# EAGLE design cpu_board (EAGLE 7.2.0)
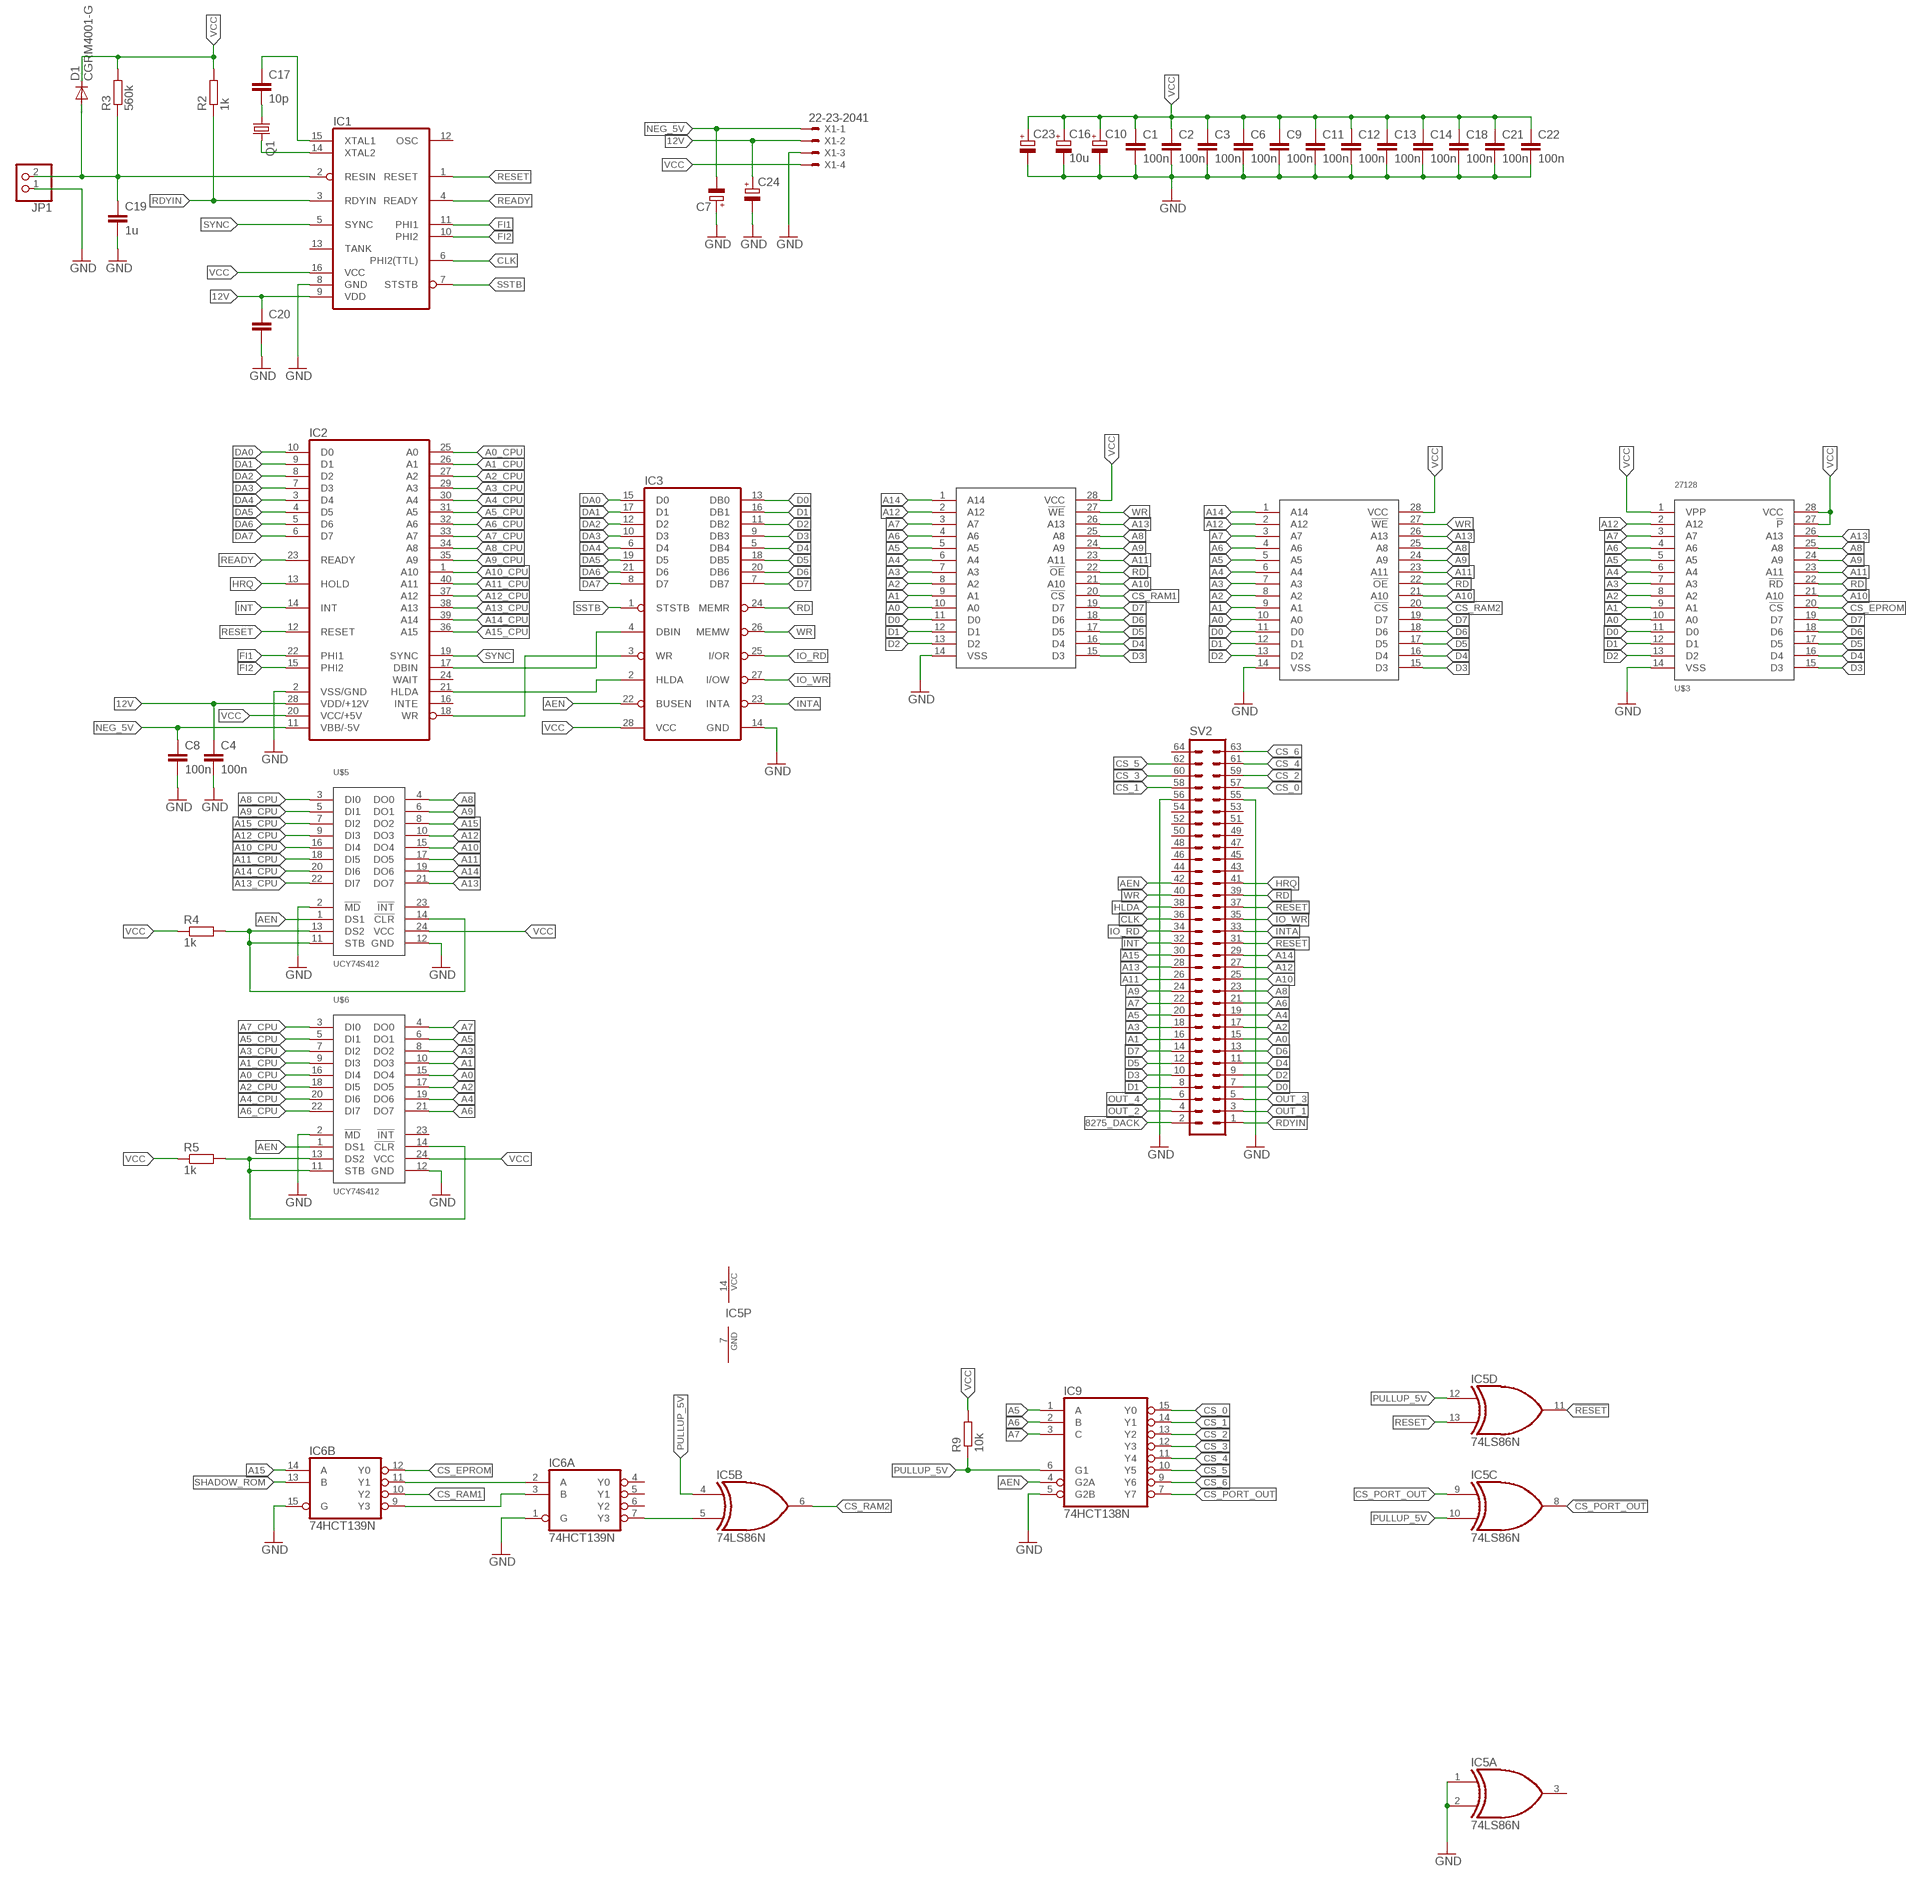
[diagram p0: schematic, sheet 1, part 1 of 2]
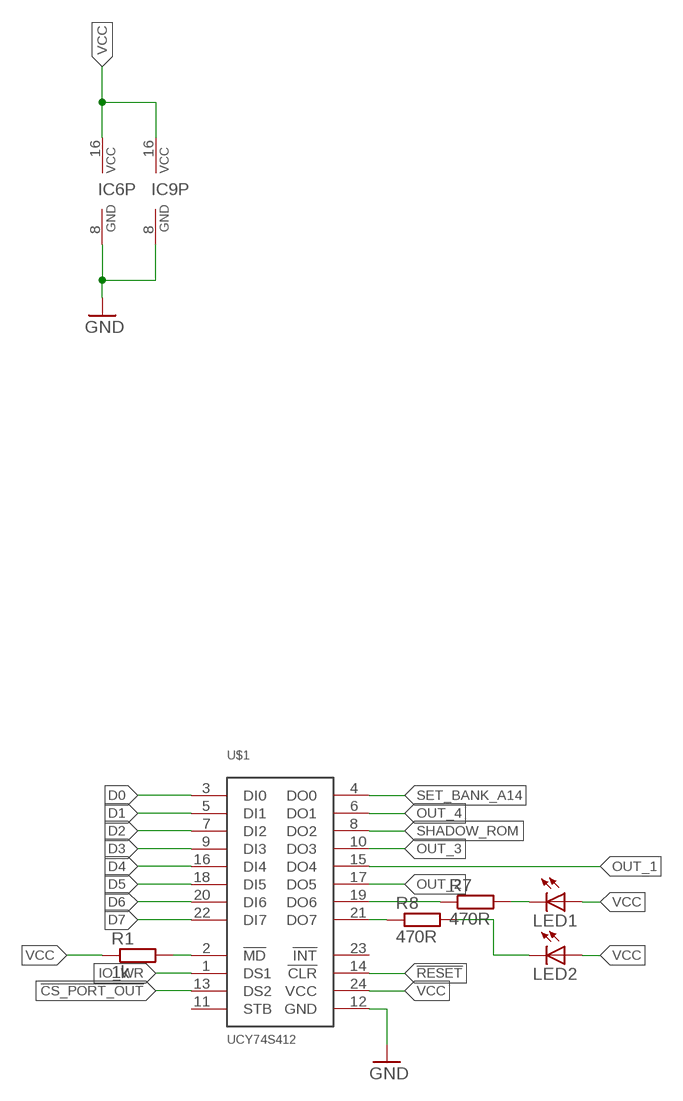
[diagram p1: schematic, sheet 1, part 2 of 2]

## Parts
C1  100n  C-EUC1206  [C1206]
C2  100n  C-EUC1206  [C1206]
C3  100n  C-EUC1206  [C1206]
C4  100n  C-EUC1206  [C1206]
C6  100n  C-EUC1206  [C1206]
C7  CPOL-EUE2.5-7  [E2,5-7]
C8  100n  C-EUC1206  [C1206]
C9  100n  C-EUC1206  [C1206]
C10  CPOL-EUE5-10.5  [E5-10,5]
C11  100n  C-EUC0805  [C0805]
C12  100n  C-EUC0805  [C0805]
C13  100n  C-EUC0805  [C0805]
C14  100n  C-EUC1206  [C1206]
C16  10u  CPOL-EUSMCB  [SMC_B]
C17  10p  C-EUC0603  [C0603]
C18  100n  C-EUC0603  [C0603]
C19  1u  C-EUC0603  [C0603]
C20  C-EUC0603  [C0603]
C21  100n  C-EUC1206  [C1206]
C22  100n  C-EUC0603  [C0603]
C23  CPOL-EUE5-10.5  [E5-10,5]
C24  CPOL-EUE3.5-8  [E3,5-8]
D1  CGRM4001-G  [SOD-123_MINI-SMA]
IC1  8224  [DIL16]
IC2  8080  [DIL40]
IC3  8228  [DIL28-6]
IC5  74LS86N  [DIL14]
IC6  74HCT139N  [DIL16]
IC9  74HCT138N  [DIL16]
JP1  PINHD-1X2  [1X02]
LED1  LED3MM  [LED3MM]
LED2  LED3MM  [LED3MM]
Q1  CRYSTALHC49U-V  [HC49U-V]
R1  1k  R-EU_M1206  [M1206]
R2  1k  R-EU_R0603  [R0603]
R3  560k  R-EU_R0603  [R0603]
R4  1k  R-EU_R0603  [R0603]
R5  1k  R-EU_0204/7  [0204/7]
R7  470R  R-EU_R0603  [R0603]
R8  470R  R-EU_R0603  [R0603]
R9  10k  R-EU_R0603  [R0603]
SV2  ML64L  [ML64L]
U$1  UCY74S412  [DIL24-6]
U$2  62256  [DIL28-6]
U$3  27128  [DIL28]
U$4  62256  [DIL28-6]
U$5  UCY74S412  [DIL24-6]
U$6  UCY74S412  [DIL24-6]
X1  22-23-2041  [22-23-2041]

## Nets
12V: C4.1 C20.1 C24.+ IC1.9(VDD) IC2.28(VDD/+12V) X1.2
8275_DACK: SV2.2
!CS_PORT_OUT: IC5.8(C:O) U$1.13(DS2)
!RESET: IC5.11(D:O) SV2.37 U$1.14(!CLR)
A0: SV2.15 U$2.10(A0) U$3.10(A0) U$4.10(A0) U$6.15(DO4)
A0_CPU: IC2.25(A0) U$6.16(DI4)
A1: SV2.16 U$2.9(A1) U$3.9(A1) U$4.9(A1) U$6.10(DO3)
A1_CPU: IC2.26(A1) U$6.9(DI3)
A2: SV2.17 U$2.8(A2) U$3.8(A2) U$4.8(A2) U$6.17(DO5)
A2_CPU: IC2.27(A2) U$6.18(DI5)
A3: SV2.18 U$2.7(A3) U$3.7(A3) U$4.7(A3) U$6.8(DO2)
A3_CPU: IC2.29(A3) U$6.7(DI2)
A4: SV2.19 U$2.6(A4) U$3.6(A4) U$4.6(A4) U$6.19(DO6)
A4_CPU: IC2.30(A4) U$6.20(DI6)
A5: IC9.1(A) SV2.20 U$2.5(A5) U$3.5(A5) U$4.5(A5) U$6.6(DO1)
A5_CPU: IC2.31(A5) U$6.5(DI1)
A6: IC9.2(B) SV2.21 U$2.4(A6) U$3.4(A6) U$4.4(A6) U$6.21(DO7)
A6_CPU: IC2.32(A6) U$6.22(DI7)
A7: IC9.3(C) SV2.22 U$2.3(A7) U$3.3(A7) U$4.3(A7) U$6.4(DO0)
A7_CPU: IC2.33(A7) U$6.3(DI0)
A8: SV2.23 U$2.25(A8) U$3.25(A8) U$4.25(A8) U$5.4(DO0)
A8_CPU: IC2.34(A8) U$5.3(DI0)
A9: SV2.24 U$2.24(A9) U$3.24(A9) U$4.24(A9) U$5.6(DO1)
A9_CPU: IC2.35(A9) U$5.5(DI1)
A10: SV2.25 U$2.21(A10) U$3.21(A10) U$4.21(A10) U$5.15(DO4)
A10_CPU: IC2.1(A10) U$5.16(DI4)
A11: SV2.26 U$2.23(A11) U$3.23(A11) U$4.23(A11) U$5.17(DO5)
A11_CPU: IC2.40(A11) U$5.18(DI5)
A12: SV2.27 U$2.2(A12) U$3.2(A12) U$4.2(A12) U$5.10(DO3)
A12_CPU: IC2.37(A12) U$5.9(DI3)
A13: SV2.28 U$2.26(A13) U$3.26(A13) U$4.26(A13) U$5.21(DO7)
A13_CPU: IC2.38(A13) U$5.22(DI7)
A14: SV2.29 U$2.1(A14) U$4.1(A14) U$5.19(DO6)
A14_CPU: IC2.39(A14) U$5.20(DI6)
A15: IC6.14(B:A) SV2.30 U$5.8(DO2)
A15_CPU: IC2.36(A15) U$5.7(DI2)
AEN: IC3.22(BUSEN) IC9.4(G2A) SV2.42 U$5.1(DS1) U$6.1(DS1)
CLK: IC1.6(PHI2(TTL)) SV2.36
CS_0: IC9.15(Y0) SV2.57
CS_1: IC9.14(Y1) SV2.58
CS_2: IC9.13(Y2) SV2.59
CS_3: IC9.12(Y3) SV2.60
CS_4: IC9.11(Y4) SV2.61
CS_5: IC9.10(Y5) SV2.62
CS_6: IC9.9(Y6) SV2.63
CS_EPROM: IC6.12(B:Y0) U$3.20(!CS)
CS_PORT_OUT: IC5.9(C:I0) IC9.7(Y7)
CS_RAM1: IC6.10(B:Y2) U$4.20(!CS)
CS_RAM2: IC5.6(B:O) U$2.20(!CS)
D0: IC3.13(DB0) SV2.7 U$1.3(DI0) U$2.11(D0) U$3.11(D0) U$4.11(D0)
D1: IC3.16(DB1) SV2.8 U$1.5(DI1) U$2.12(D1) U$3.12(D1) U$4.12(D1)
D2: IC3.11(DB2) SV2.9 U$1.7(DI2) U$2.13(D2) U$3.13(D2) U$4.13(D2)
D3: IC3.9(DB3) SV2.10 U$1.9(DI3) U$2.15(D3) U$3.15(D3) U$4.15(D3)
D4: IC3.5(DB4) SV2.11 U$1.16(DI4) U$2.16(D4) U$3.16(D4) U$4.16(D4)
D5: IC3.18(DB5) SV2.12 U$1.18(DI5) U$2.17(D5) U$3.17(D5) U$4.17(D5)
D6: IC3.20(DB6) SV2.13 U$1.20(DI6) U$2.18(D6) U$3.18(D6) U$4.18(D6)
D7: IC3.7(DB7) SV2.14 U$1.22(DI7) U$2.19(D7) U$3.19(D7) U$4.19(D7)
DA0: IC2.10(D0) IC3.15(D0)
DA1: IC2.9(D1) IC3.17(D1)
DA2: IC2.8(D2) IC3.12(D2)
DA3: IC2.7(D3) IC3.10(D3)
DA4: IC2.3(D4) IC3.6(D4)
DA5: IC2.4(D5) IC3.19(D5)
DA6: IC2.5(D6) IC3.21(D6)
DA7: IC2.6(D7) IC3.8(D7)
FI1: IC1.11(PHI1) IC2.22(PHI1)
FI2: IC1.10(PHI2) IC2.15(PHI2)
GND: C1.2 C2.2 C3.2 C4.2 C6.2 C7.+ C8.2 C9.2 C10.- C11.2 C12.2 C13.2 C14.2 C16.- C18.2 C19.2 C20.2 C21.2 C22.2 C23.- C24.- IC1.8(GND) IC2.2(VSS/GND) IC3.14(GND) IC5.1(A:I0) IC5.2(A:I1) IC6.1(A:G) IC6.8(P:GND) IC6.15(B:G) IC9.5(G2B) IC9.8(GND) JP1.1 SV2.55 SV2.56 U$1.12(GND) U$2.14(VSS) U$3.14(VSS) U$4.14(VSS) U$5.2(!MD) U$5.12(GND) U$6.2(!MD) U$6.12(GND) X1.3
HLDA: IC2.21(HLDA) IC3.2(HLDA) SV2.38
HRQ: IC2.13(HOLD) SV2.41
INT: IC2.14(INT) SV2.32
INTA: IC3.23(INTA) SV2.33
IO_RD: IC3.25(I/OR) SV2.34
IO_WR: IC3.27(I/OW) SV2.35 U$1.1(DS1)
N$1: IC2.17(DBIN) IC3.4(DBIN)
N$2: IC6.2(A:A) IC6.11(B:Y1)
N$3: R7.1 U$1.19(DO6)
N$4: LED1.K(C) R7.2
N$5: IC2.18(WR) IC3.3(WR)
N$6: R8.1 U$1.21(DO7)
N$7: R1.2 U$1.2(!MD)
N$8: IC6.3(A:B) IC6.9(B:Y3)
N$9: IC1.14(XTAL2) Q1.2
N$10: C17.2 Q1.1
N$11: C17.1 IC1.15(XTAL1)
N$12: C19.1 D1.A IC1.2(RESIN) JP1.2 R3.1
N$13: R5.2 U$6.11(STB) U$6.13(DS2) U$6.14(!CLR)
N$15: R4.2 U$5.11(STB) U$5.13(DS2) U$5.14(!CLR)
N$16: IC5.5(B:I1) IC6.7(A:Y3)
N$17: LED2.K(C) R8.2
NEG_5V: C7.- C8.1 IC2.11(VBB/-5V) X1.1
OUT_1: SV2.3 U$1.15(DO4)
OUT_2: SV2.4 U$1.17(DO5)
OUT_3: SV2.5 U$1.10(DO3)
OUT_4: SV2.6 U$1.6(DO1)
PULLUP_5V: IC5.4(B:I0) IC5.10(C:I1) IC5.12(D:I0) IC9.6(G1) R9.1
RD: IC3.24(MEMR) SV2.39 U$2.22(!OE) U$3.22(!RD) U$4.22(!OE)
RDYIN: IC1.3(RDYIN) R2.1 SV2.1
READY: IC1.4(READY) IC2.23(READY)
RESET: IC1.1(RESET) IC2.12(RESET) IC5.13(D:I1) SV2.31
SET_BANK_A14: U$1.4(DO0)
SHADOW_ROM: IC6.13(B:B) U$1.8(DO2)
SSTB: IC1.7(STSTB) IC3.1(STSTB)
SYNC: IC1.5(SYNC) IC2.19(SYNC)
VCC: C1.1 C2.1 C3.1 C6.1 C9.1 C10.+ C11.1 C12.1 C13.1 C14.1 C16.+ C18.1 C21.1 C22.1 C23.+ D1.C IC1.16(VCC) IC2.20(VCC/+5V) IC3.28(VCC) IC6.16(P:VCC) IC9.16(VCC) LED1.A LED2.A R1.1 R2.2 R3.2 R4.1 R5.1 R9.2 U$1.24(VCC) U$2.28(VCC) U$3.1(VPP) U$3.27(!P) U$3.28(VCC) U$4.28(VCC) U$5.24(VCC) U$6.24(VCC) X1.4
WR: IC3.26(MEMW) SV2.40 U$2.27(!WE) U$4.27(!WE)
Unconnected: IC1.12(OSC) IC1.13(TANK) IC2.16(INTE) IC2.24(WAIT) IC5.3(A:O) IC6.4(A:Y0) IC6.5(A:Y1) IC6.6(A:Y2) SV2.43 SV2.44 SV2.45 SV2.46 SV2.47 SV2.48 SV2.49 SV2.50 SV2.51 SV2.52 SV2.53 SV2.54 SV2.64 U$1.11(STB) U$1.23(!INT) U$5.23(!INT) U$6.23(!INT)

## Power pins joined to a net without a drawn wire
GND: IC5.7(P:GND)
VCC: IC5.14(P:VCC)

## Library data of the parts
C1-C4 C6 C8 C9 C11-C14 C17-C22 = rcl:C-EU: CAPACITOR, European symbol
C7 C10 C16 C23 C24 = rcl:CPOL-EU: POLARIZED CAPACITOR, European symbol
D1 = diode:CGRM400*-G: Molded plasitc,JEDEC SOD-123/Mini SMA Source: Comchip CGRM4001-G.pdf
IC1 = micro-intel:8224: MICROCOMPUTER/PERIPHERAL DEVICE; OC_FARNELL: unknown; OC_NEWARK: unknown
IC2 = micro-intel:8080: MICROCOMPUTER/PERIPHERAL DEVICE; OC_FARNELL: unknown; OC_NEWARK: unknown
IC3 = micro-intel:8228: MICROCOMPUTER/PERIPHERAL DEVICE; OC_FARNELL: unknown; OC_NEWARK: unknown
IC5 = 74xx-us:74*86: Quad 2-input EXCLUSIV-OR (XOR) gate
IC6 = 74xx-eu:74*139: Dual 2-line to 4-line DECODER/DEMULTIPLEXER
IC9 = 74xx-eu:74*138: 3-line to 8-line DECODER/DEMULTIPLEXER
JP1 = pinhead:PINHD-1X2: PIN HEADER
LED1 LED2 = led:LED: LED OSRAM: - CHIPLED LG R971, LG N971, LY N971, LG Q971, LY Q971, LO R971, LY R971 LH N974, LH R974 LS Q976, LO Q976, LY Q976 LO Q996 - Hyper CHIPLED LW Q18S LB Q993, LB Q99A, LB R99A - SideLED LS A670, LO A670, LY A670, LG A670, LP A670 LB A673, LV A673, LT A673, LW A673 LH A674 LY A675 LS A676, LA A676, LO A676, LY A676, LW A676 LS A679, LY A679, LG A679 - Hyper Micro SIDELED® LS Y876, LA Y876, LO Y876, LY Y876 LT Y87S - SmartLED LW L88C, LW L88S LB L89C, LB L89S, LG L890 LS L89K, LO L89K, LY L89K LS L896, LA L896, LO L896, LY L896 - TOPLED LS T670, LO T670, LY T670, LG T670, LP T670 LSG T670, LSP T670, LSY T670, LOP T670, LYG T670 LG T671, LOG T671, LSG T671 LB T673, LV T673, LT T673, LW T673 LH T674 LS T676, LA T676, LO T676, LY T676, LB T676, LH T676, LSB T676, LW T676 LB T67C, LV T67C, LT T67C, LS T67K, LO T67K, LY T67K, LW E67C LS E67B, LA E67B, LO E67B, LY E67B, LB E67C, LV E67C, LT E67C LW T67C LS T679, LY T679, LG T679 LS T770, LO T770, LY T770, LG T770, LP T770 LB T773, LV T773, LT T773, LW T773 LH T774 LS E675, LA E675, LY E675, LS T675 LS T776, LA T776, LO T776, LY T776, LB T776 LHGB T686 LT T68C, LB T68C - Hyper Mini TOPLED® LB M676 - Mini TOPLED Santana® LG M470 LS M47K, LO M47K, LY M47K Source: http://www.osram.convergy.de LUXEON: - LUMILED® LXK2-PW12-R00, LXK2-PW12-S00, LXK2-PW14-U00, LXK2-PW14-V00 LXK2-PM12-R00, LXK2-PM12-S00, LXK2-PM14-U00 LXK2-PE12-Q00, LXK2-PE12-R00, LXK2-PE12-S00, LXK2-PE14-T00, LXK2-PE14-U00 LXK2-PB12-K00, LXK2-PB12-L00, LXK2-PB12-M00, LXK2-PB14-N00, LXK2-PB14-P00, LXK2-PB14-Q00 LXK2-PR12-L00, LXK2-PR12-M00, LXK2-PR14-Q00, LXK2-PR14-R00 LXK2-PD12-Q00, LXK2-PD12-R00, LXK2-PD12-S00 LXK2-PH12-R00, LXK2-PH12-S00 LXK2-PL12-P00, LXK2-PL12-Q00, LXK2-PL12-R00 Source: www.luxeon.com KINGBRIGHT: KA-3528ASYC Source: www.kingbright.com
Q1 = crystal:CRYSTAL: CRYSTAL; OC_FARNELL: 1666969; OC_NEWARK: unknown
R1-R5 R7-R9 = rcl:R-EU_: RESISTOR, European symbol
SV2 = con-harting-ml:ML64: HARTING; OC_FARNELL: unknown; OC_NEWARK: unknown
U$1 U$5 U$6 = mw:UCY74S412
U$2 U$4 = memory-sram:62256
U$3 = mw:27128
X1 = con-molex:22-23-2041: .100" (2.54mm) Center Header - 4 Pin; MF: MOLEX; MPN: 22-23-2041; OC_FARNELL: 1462920; OC_NEWARK: 38C0355

## Board
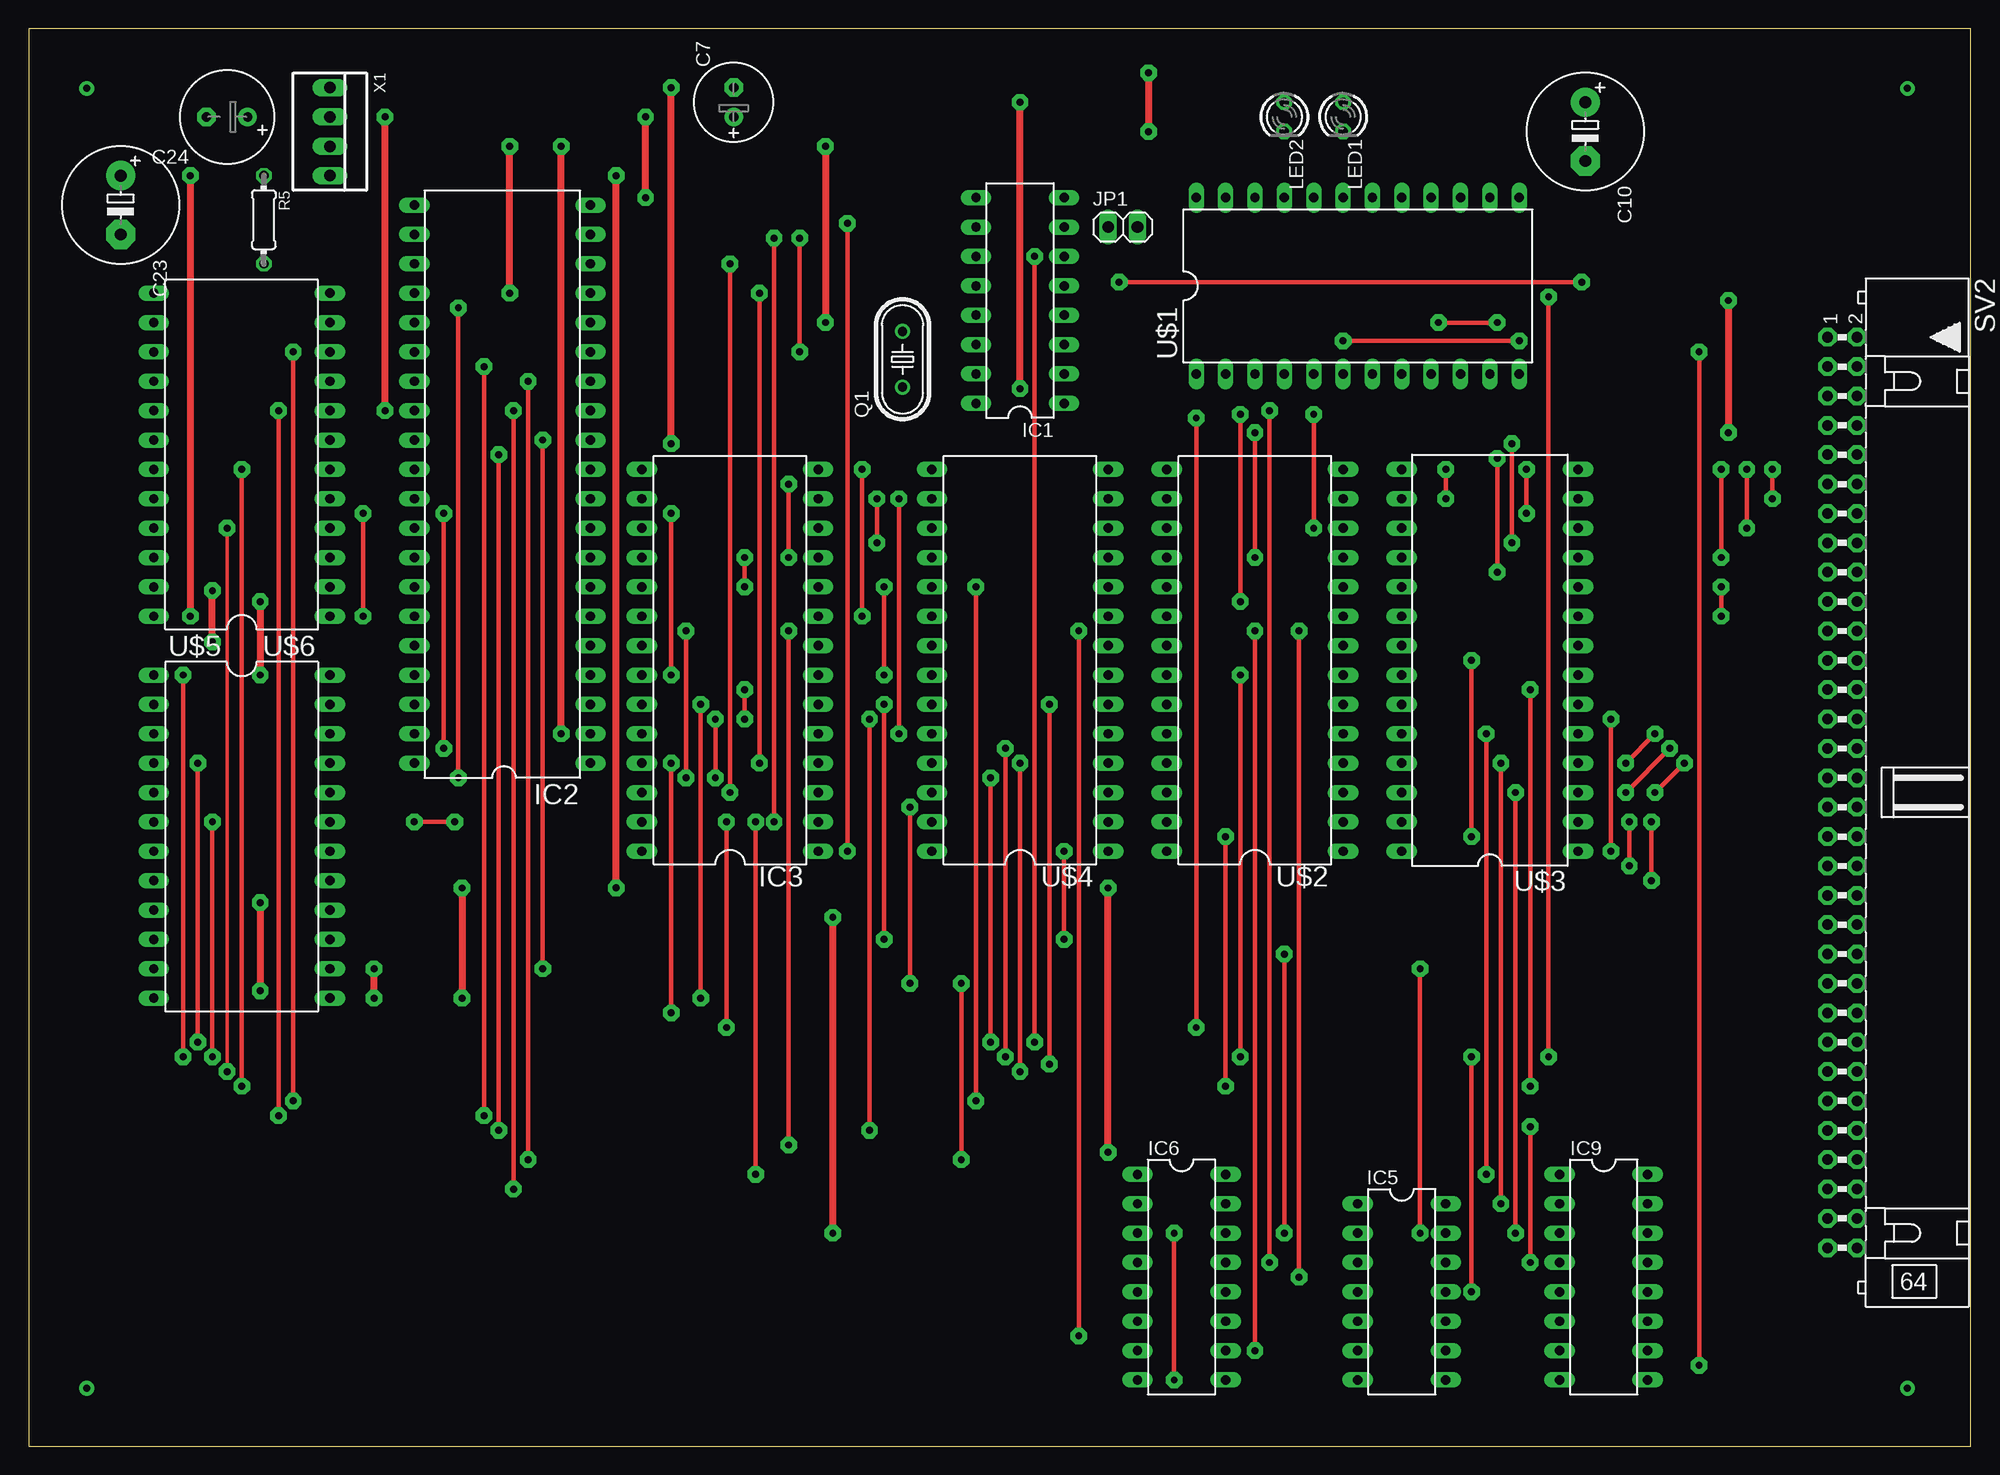
[diagram p2: board, top side]
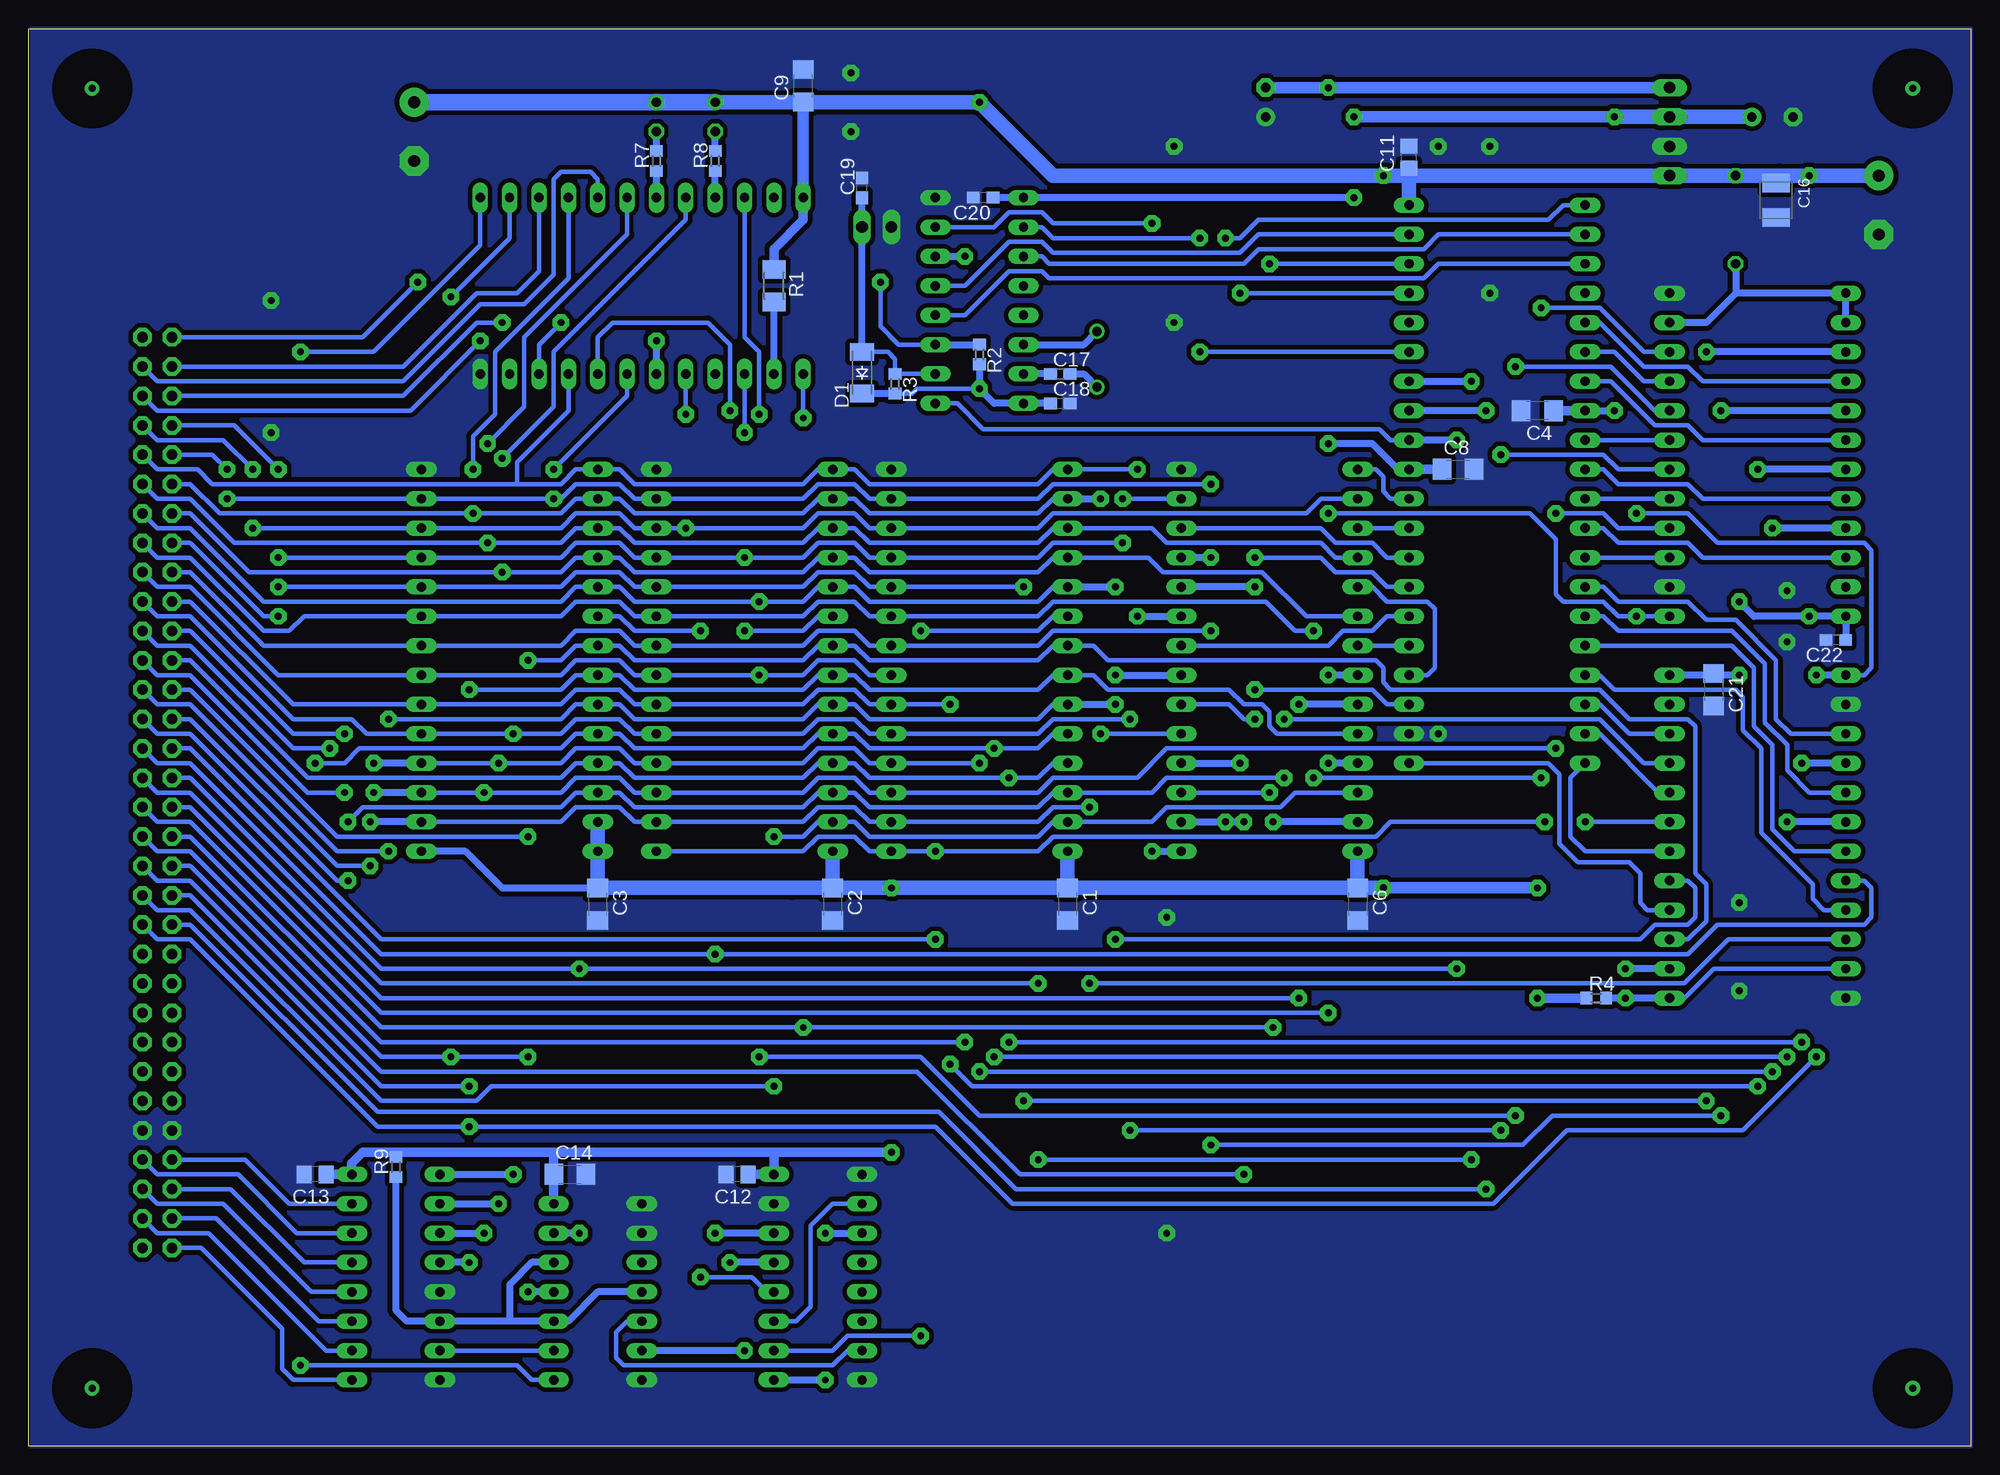
[diagram p3: board, bottom side, seen from below]

Size 167.94 x 122.55 mm. Coordinates in mm from the lower left corner, seen from the top.
Outline: 0,0 167.94,0 167.94,122.55 0,122.55 0,0
Copper layers (1*16): Top 0.035mm / dielectric 1.5mm / Bottom 0.035mm
Design rules "default *": minimum track width 10mil, minimum drill 24mil, track to track 8mil, track to pad 8mil, pad to pad 8mil, via to via 8mil, smd to smd 8mil, copper to edge 0mil, drill to drill 8mil, minimum pad ring 10mil, minimum via ring 8mil, stop-mask expansion 4mil, vias tented up to drill 0mil, thermal gap 10mil
bRestrict: area 2,2 to 8,8; area 2,114.3 to 8,120.4; area 159.4,2 to 165.5,8; area 159.4,114.3 to 165.5,120.4

### Footprints (pad centres in the part's own frame; a part is rotated, then mirrored left to right if it is on the bottom)
C1206 = smd 1.6 x 1.8: 1 -1.4,0; 2 1.4,0
E2,5-7 = drill 0.813 pad 1.6: + -1.27,0 | drill 0.813 pad 1.6 octagon: - 1.27,0
E5-10,5 = drill 1.016 pad 2.54: + -2.54,0 | drill 1.016 pad 2.54 octagon: - 2.54,0
C0805 = smd 1.3 x 1.5: 1 -0.95,0; 2 0.95,0
SMC_B = smd 1.6 x 2.4: + -1.5,0; - 1.5,0
C0603 = smd 1.1 x 1: 1 -0.85,0; 2 0.85,0
E3,5-8 = drill 0.813 pad 1.6: + -1.778,0 | drill 0.813 pad 1.6 octagon: - 1.778,0
SOD-123_MINI-SMA = smd 1.5 x 2.1: A 1.8,0; C -1.8,0
DIL16 = drill 0.813 long: 1 -8.89,-3.81; 2 -6.35,-3.81; 3 -3.81,-3.81; 4 -1.27,-3.81; 5 1.27,-3.81; 6 3.81,-3.81; 7 6.35,-3.81; 8 8.89,-3.81; 9 8.89,3.81; 10 6.35,3.81; 11 3.81,3.81; 12 1.27,3.81; 13 -1.27,3.81; 14 -3.81,3.81; 15 -6.35,3.81; 16 -8.89,3.81
DIL40 = drill 0.813 long: 1 -24.13,-7.62; 2 -21.59,-7.62; 3 -19.05,-7.62; 4 -16.51,-7.62; 5 -13.97,-7.62; 6 -11.43,-7.62; 7 -8.89,-7.62; 8 -6.35,-7.62; 9 -3.81,-7.62; 10 -1.27,-7.62; 11 1.27,-7.62; 12 3.81,-7.62; 13 6.35,-7.62; 14 8.89,-7.62; 15 11.43,-7.62; 16 13.97,-7.62; 17 16.51,-7.62; 18 19.05,-7.62; 19 21.59,-7.62; 20 24.13,-7.62; 21 24.13,7.62; 22 21.59,7.62; 23 19.05,7.62; 24 16.51,7.62; 25 13.97,7.62; 26 11.43,7.62; 27 8.89,7.62; 28 6.35,7.62; 29 3.81,7.62; 30 1.27,7.62; 31 -1.27,7.62; 32 -3.81,7.62; 33 -6.35,7.62; 34 -8.89,7.62; 35 -11.43,7.62; 36 -13.97,7.62; 37 -16.51,7.62; 38 -19.05,7.62; 39 -21.59,7.62; 40 -24.13,7.62
DIL28-6 = drill 0.813 long: 1 -16.51,-7.62; 2 -13.97,-7.62; 3 -11.43,-7.62; 4 -8.89,-7.62; 5 -6.35,-7.62; 6 -3.81,-7.62; 7 -1.27,-7.62; 8 1.27,-7.62; 9 3.81,-7.62; 10 6.35,-7.62; 11 8.89,-7.62; 12 11.43,-7.62; 13 13.97,-7.62; 14 16.51,-7.62; 15 16.51,7.62; 16 13.97,7.62; 17 11.43,7.62; 18 8.89,7.62; 19 6.35,7.62; 20 3.81,7.62; 21 1.27,7.62; 22 -1.27,7.62; 23 -3.81,7.62; 24 -6.35,7.62; 25 -8.89,7.62; 26 -11.43,7.62; 27 -13.97,7.62; 28 -16.51,7.62
DIL14 = drill 0.813 long: 1 -7.62,-3.81; 2 -5.08,-3.81; 3 -2.54,-3.81; 4 0,-3.81; 5 2.54,-3.81; 6 5.08,-3.81; 7 7.62,-3.81; 8 7.62,3.81; 9 5.08,3.81; 10 2.54,3.81; 11 0,3.81; 12 -2.54,3.81; 13 -5.08,3.81; 14 -7.62,3.81
1X02 = drill 1.016 long: 1 -1.27,0; 2 1.27,0
LED3MM = drill 0.813 octagon: A -1.27,0; K 1.27,0
HC49U-V = drill 0.813: 1 -2.413,0; 2 2.413,0
M1206 = smd 1.6 x 2: 1 -1.4,0; 2 1.4,0
R0603 = smd 1 x 1.1: 1 -0.85,0; 2 0.85,0
0204/7 = drill 0.813 octagon: 1 -3.81,0; 2 3.81,0
ML64L = drill 0.914 pad 1.6 octagon: 1 -39.37,-1.27; 2 -39.37,1.27; 3 -36.83,-1.27; 4 -36.83,1.27; 5 -34.29,-1.27; 6 -34.29,1.27; 7 -31.75,-1.27; 8 -31.75,1.27; 9 -29.21,-1.27; 10 -29.21,1.27; 11 -26.67,-1.27; 12 -26.67,1.27; 13 -24.13,-1.27; 14 -24.13,1.27; 15 -21.59,-1.27; 16 -21.59,1.27; 17 -19.05,-1.27; 18 -19.05,1.27; 19 -16.51,-1.27; 20 -16.51,1.27; 21 -13.97,-1.27; 22 -13.97,1.27; 23 -11.43,-1.27; 24 -11.43,1.27; 25 -8.89,-1.27; 26 -8.89,1.27; 27 -6.35,-1.27; 28 -6.35,1.27; 29 -3.81,-1.27; 30 -3.81,1.27; 31 -1.27,-1.27; 32 -1.27,1.27; 33 1.27,-1.27; 34 1.27,1.27; 35 3.81,-1.27; 36 3.81,1.27; 37 6.35,-1.27; 38 6.35,1.27; 39 8.89,-1.27; 40 8.89,1.27; 41 11.43,-1.27; 42 11.43,1.27; 43 13.97,-1.27; 44 13.97,1.27; 45 16.51,-1.27; 46 16.51,1.27; 47 19.05,-1.27; 48 19.05,1.27; 49 21.59,-1.27; 50 21.59,1.27; 51 24.13,-1.27; 52 24.13,1.27; 53 26.67,-1.27; 54 26.67,1.27; 55 29.21,-1.27; 56 29.21,1.27; 57 31.75,-1.27; 58 31.75,1.27; 59 34.29,-1.27; 60 34.29,1.27; 61 36.83,-1.27; 62 36.83,1.27; 63 39.37,-1.27; 64 39.37,1.27
DIL24-6 = drill 0.813 long: 1 -13.97,-7.62; 2 -11.43,-7.62; 3 -8.89,-7.62; 4 -6.35,-7.62; 5 -3.81,-7.62; 6 -1.27,-7.62; 7 1.27,-7.62; 8 3.81,-7.62; 9 6.35,-7.62; 10 8.89,-7.62; 11 11.43,-7.62; 12 13.97,-7.62; 13 13.97,7.62; 14 11.43,7.62; 15 8.89,7.62; 16 6.35,7.62; 17 3.81,7.62; 18 1.27,7.62; 19 -1.27,7.62; 20 -3.81,7.62; 21 -6.35,7.62; 22 -8.89,7.62; 23 -11.43,7.62; 24 -13.97,7.62
DIL28 = drill 0.813 long: 1 -16.51,-7.62; 2 -13.97,-7.62; 3 -11.43,-7.62; 4 -8.89,-7.62; 5 -6.35,-7.62; 6 -3.81,-7.62; 7 -1.27,-7.62; 8 1.27,-7.62; 9 3.81,-7.62; 10 6.35,-7.62; 11 8.89,-7.62; 12 11.43,-7.62; 13 13.97,-7.62; 14 16.51,-7.62; 15 16.51,7.62; 16 13.97,7.62; 17 11.43,7.62; 18 8.89,7.62; 19 6.35,7.62; 20 3.81,7.62; 21 1.27,7.62; 22 -1.27,7.62; 23 -3.81,7.62; 24 -6.35,7.62; 25 -8.89,7.62; 26 -11.43,7.62; 27 -13.97,7.62; 28 -16.51,7.62
22-23-2041 = drill 1 long: 1 -3.81,0; 2 -1.27,0; 3 1.27,0; 4 3.81,0

### Placement (x,y rotation side)
C1  78.11,46.86 270 bottom
C2  98.42,46.86 270 bottom
C3  118.75,46.84 270 bottom
C4  37.47,89.53 180 bottom
C6  53.02,46.86 270 bottom
C7  60.96,116.2 90 top
C8  44.32,84.45 0 bottom
C9  100.97,117.61 90 bottom
C10  134.62,113.67 270 top
C11  48.58,111.44 90 bottom
C12  106.68,23.5 180 bottom
C13  143.19,23.5 180 bottom
C14  121.16,23.5 0 bottom
C16  16.83,107.72 270 bottom
C17  78.74,92.71 0 bottom
C18  78.74,90.17 0 bottom
C19  95.89,108.79 90 bottom
C20  85.41,107.95 180 bottom
C21  22.23,65.41 270 bottom
C22  11.66,69.71 180 bottom
C23  7.94,107.31 270 top
C24  17.14,114.94 180 top
D1  95.89,92.81 90 bottom
IC1  85.72,99.06 90 top
IC2  40.96,83.19 90 top
IC3  60.64,67.94 90 top
IC5  118.75,13.34 270 top
IC6  99.69,14.61 270 top
IC9  136.21,14.61 270 top
JP1  94.61,105.41 0 top
LED1  113.67,114.94 270 top
LED2  108.58,114.94 270 top
Q1  75.56,93.98 90 top
R1  103.5,100.33 270 bottom
R2  85.72,94.4 270 bottom
R3  93.03,91.86 270 bottom
R4  32.38,38.73 0 bottom
R5  20.32,106.05 270 top
R7  113.67,111.12 90 bottom
R8  108.58,111.12 90 bottom
R9  136.21,24.13 90 bottom
SV2  156.84,56.52 270 top
U$1  114.94,100.33 0 top
U$2  106.05,67.94 90 top
U$3  126.36,67.94 90 top
U$4  85.72,67.94 90 top
U$5  18.41,52.7 270 top
U$6  18.41,85.72 90 top
X1  26.04,113.67 270 top

### Tracks (layer width: path | path; a pad name or v marks a point on that pad's centre or on a via)
12V  (via drill 0.6 pad 1.42)
  Top 0.61: v30.8,89.53 v30.8,114.94 | v53.34,107.95 v53.34,114.94
  Bottom 0.61: IC2.28 v30.8,89.53 | C20.1 IC1.9 v53.34,107.95
  Bottom 0.813: C4.1 IC2.28
  Bottom 1.016: v30.8,114.94 v53.34,114.94
  Bottom 1.27: v30.8,114.94 X1.2 C24.+
!CS_PORT_OUT  (via drill 0.6 pad 1.42)
  Top 0.406: v144.46,94.61 v144.46,6.99
  Bottom 0.406: v144.46,6.99 125.73,6.99 124.46,5.71 IC5.8 | v144.46,94.61 138.11,94.61 128.91,103.82 U$1.13
!RESET  (via drill 0.6 pad 1.42)
  Top 0.406: v124.78,13.34 v124.78,33.66 | v131.44,33.66 v131.44,99.38
  Bottom 0.406: U$1.14 126.36,104.46 v131.44,99.38 | SV2.37 153.99,50.16 137.48,33.66 v131.44,33.66 v124.78,33.66
  Bottom 0.61: IC5.11 v124.78,13.34
A0  (via drill 0.6 pad 1.42)
  Top 0.406: v146.37,74.3 v146.37,71.75 | v22.86,94.61 v22.86,29.84 | v81.92,74.3 v81.92,29.84
  Bottom 0.406: v146.37,74.3 U$3.10 121.92,74.3 120.65,75.56 116.84,75.56 115.57,74.3 U$2.10 100.97,74.3 99.69,75.56 96.52,75.56 95.25,74.3 U$4.10 v81.92,74.3 | SV2.15 153.99,78.11 147.64,71.75 v146.37,71.75 | v22.86,29.84 v81.92,29.84
  Bottom 0.61: U$6.15 v22.86,94.61
A0_CPU
  Bottom 0.406: U$6.16 23.18,92.08 24.45,93.34 28.26,93.34 32.07,97.16 IC2.25
A1  (via drill 0.6 pad 1.42)
  Top 0.406: v37.15,98.42 v37.15,57.78 | v56.83,70.48 v56.83,57.78
  Bottom 0.406: SV2.16 156.84,76.83 153.99,76.83 147.64,70.48 145.41,70.48 144.15,71.75 U$3.9 121.92,71.75 120.65,73.03 116.84,73.03 115.57,71.75 U$2.9 100.97,71.75 99.69,73.03 96.52,73.03 95.25,71.75 U$4.9 80.64,71.75 79.38,73.03 60.96,73.03 58.42,70.48 v56.83,70.48 | U$6.10 28.26,94.61 32.07,98.42 v37.15,98.42 | v37.15,57.78 v56.83,57.78
A1_CPU
  Bottom 0.406: U$6.9 28.26,92.08 30.8,94.61 IC2.26
A2  (via drill 0.6 pad 1.42)
  Top 0.406: v21.59,89.53 v21.59,28.57 | v65.72,70.48 v65.72,26.04
  Bottom 0.406: SV2.17 153.99,75.56 147.64,69.22 U$3.8 121.92,69.22 120.65,70.48 116.84,70.48 115.57,69.22 U$2.8 100.97,69.22 99.69,70.48 96.52,70.48 95.25,69.22 U$4.8 80.64,69.22 79.38,70.48 v65.72,70.48 | v21.59,28.57 36.2,28.57 38.73,26.04 v65.72,26.04
  Bottom 0.61: U$6.17 v21.59,89.53
A2_CPU
  Bottom 0.406: U$6.18 23.18,87 24.45,88.27 27.3,88.27 31.11,92.08 IC2.27
A3  (via drill 0.6 pad 1.42)
  Top 0.406: v39.37,93.34 v39.37,28.57 | v104.78,66.67 v104.78,33.66
  Bottom 0.406: U$4.7 95.25,66.67 96.52,67.94 99.69,67.94 100.97,66.67 v104.78,66.67 U$2.7 115.57,66.67 116.84,67.94 120.65,67.94 121.92,66.67 U$3.7 146.37,66.67 153.99,74.3 156.84,74.3 SV2.18 | U$6.8 27.3,89.53 31.11,93.34 v39.37,93.34 | v39.37,28.57 85.72,28.57 90.81,33.66 v104.78,33.66
A3_CPU
  Bottom 0.406: U$6.7 IC2.29
A4  (via drill 0.6 pad 1.42)
  Top 0.406: v18.41,84.45 v18.41,31.11 | v88.27,64.14 v88.27,33.02
  Bottom 0.406: v88.27,64.14 U$4.6 95.25,64.14 96.52,65.41 99.69,65.41 100.97,64.14 U$2.6 115.57,64.14 116.84,65.41 120.65,65.41 121.92,64.14 U$3.6 145.1,64.14 153.99,73.03 SV2.19 | v18.41,31.11 86.36,31.11 v88.27,33.02
  Bottom 0.61: U$6.19 v18.41,84.45
A4_CPU
  Bottom 0.406: U$6.20 23.18,81.92 24.45,83.19 30.48,83.19 31.75,84.45 IC2.30
A5  (via drill 0.6 pad 1.42)
  Top 0.406: v126.05,23.5 v126.05,61.59 | v40.64,85.72 v40.64,27.3 | v72.71,62.87 v72.71,27.3
  Bottom 0.406: v126.05,61.59 121.92,61.59 120.65,62.87 116.84,62.87 115.57,61.59 U$2.5 100.97,61.59 99.69,62.87 96.52,62.87 95.25,61.59 U$4.5 80.64,61.59 79.38,62.87 v72.71,62.87 | v126.05,61.59 U$3.5 138.75,61.59 140.02,62.87 145.1,62.87 153.99,71.75 156.84,71.75 SV2.20 | v126.05,61.59 123.83,61.59 | U$6.6 30.48,84.45 31.75,85.72 v40.64,85.72 | v40.64,27.3 v72.71,27.3
  Bottom 0.61: IC9.1 v126.05,23.5
A5_CPU
  Bottom 0.406: U$6.5 IC2.31
A6  (via drill 0.6 pad 1.42)
  Top 0.305: v17.14,79.38 v17.14,32.38
  Top 0.406: v138.11,59.05 v140.65,61.59 | v127.32,20.95 v127.32,59.05 | v85.72,59.05 v85.72,32.38
  Bottom 0.406: v127.32,59.05 121.92,59.05 120.65,60.33 116.84,60.33 115.57,59.05 U$2.4 100.97,59.05 99.69,60.33 96.52,60.33 95.25,59.05 U$4.4 v85.72,59.05 | v127.32,59.05 U$3.4 | SV2.21 153.99,70.48 145.1,61.59 v140.65,61.59 | v127.32,59.05 125.09,59.05 | v85.72,32.38 v17.14,32.38
  Bottom 0.61: U$3.4 v138.11,59.05 | IC9.2 v127.32,20.95 | U$6.21 v17.14,79.38
A6_CPU
  Bottom 0.406: U$6.22 23.18,76.83 24.45,78.11 30.48,78.11 31.75,79.38 IC2.32
A7  (via drill 0.6 pad 1.42)
  Top 0.406: v138.11,56.52 v141.92,60.33 | v128.59,18.41 v128.59,56.52 | v35.88,60.33 v35.88,80.64
  Bottom 0.406: U$3.3 v128.59,56.52 121.92,56.52 120.65,57.78 116.84,57.78 115.57,56.52 U$2.3 100.97,56.52 99.69,57.78 96.52,57.78 95.25,56.52 U$4.3 80.64,56.52 79.38,57.78 72.07,57.78 69.53,60.33 v35.88,60.33 | SV2.22 156.84,69.22 153.99,69.22 145.1,60.33 v141.92,60.33 | v35.88,80.64 31.75,80.64 30.48,79.38 U$6.4
  Bottom 0.61: U$3.3 v138.11,56.52 | IC9.3 v128.59,18.41
A7_CPU
  Bottom 0.406: U$6.3 IC2.33
A8  (via drill 0.6 pad 1.42)
  Top 0.406: v14.61,59.05 v14.61,34.92 | v83.19,57.78 v83.19,34.92
  Bottom 0.406: U$4.25 79.38,59.05 80.64,57.78 v83.19,57.78 95.25,57.78 96.52,59.05 U$2.25 99.69,59.05 100.97,57.78 115.57,57.78 116.84,59.05 U$3.25 120.65,59.05 121.92,57.78 143.83,57.78 153.99,67.94 SV2.23 | v83.19,34.92 v14.61,34.92
  Bottom 0.61: U$5.4 v14.61,59.05
A8_CPU
  Bottom 0.406: IC2.34 31.75,74.3 30.48,73.03 24.45,73.03 22.86,71.44 20.32,71.44 16.83,67.94 16.83,62.87 15.56,61.59 U$5.3
A9  (via drill 0.6 pad 1.42)
  Top 0.406: v143.19,59.05 v140.65,56.52 | v15.88,53.98 v15.88,33.66 | v84.45,60.33 v84.45,33.66
  Bottom 0.406: U$4.24 79.38,61.59 80.64,60.33 v84.45,60.33 95.25,60.33 96.52,61.59 U$2.24 99.69,61.59 100.97,60.33 115.57,60.33 116.84,61.59 U$3.24 120.65,61.59 121.92,60.33 139.38,60.33 140.65,59.05 v143.19,59.05 | SV2.24 156.84,66.67 153.99,66.67 143.83,56.52 v140.65,56.52 | v84.45,33.66 v15.88,33.66
  Bottom 0.61: U$5.6 v15.88,53.98
A9_CPU
  Bottom 0.406: IC2.35 31.75,71.75 30.48,70.48 20.64,70.48 17.78,67.63 17.78,62.55 15.88,60.64 15.88,58.42 13.97,56.52 U$5.5
A10  (via drill 0.6 pad 1.42)
  Top 0.406: v124.78,67.94 v124.78,52.7
  Bottom 0.406: v124.78,67.94 121.92,67.94 120.65,69.22 U$3.21 116.84,69.22 115.57,67.94 100.97,67.94 99.69,69.22 U$2.21 96.52,69.22 95.25,67.94 80.64,67.94 79.38,69.22 U$4.21 75.88,69.22 74.61,67.94 51.44,67.94 50.8,67.31 50.8,66.04 50.16,65.41 32.07,65.41 29.53,62.87 24.45,62.87 23.81,62.23 23.81,49.53 22.86,48.58 22.86,45.4 24.45,43.81 U$5.15 | v124.78,52.7 141.29,52.7 153.99,65.41 SV2.25
A10_CPU
  Bottom 0.406: IC2.1 36.51,59.05 35.56,58.1 35.56,52.07 33.97,50.48 29.53,50.48 28.57,49.53 28.57,46.99 27.94,46.35 U$5.16
A11  (via drill 0.6 pad 1.42)
  Top 0.406: v136.84,62.87 v136.84,51.44 | v73.98,64.14 v73.98,43.81
  Bottom 0.406: U$4.23 79.38,64.14 80.64,62.87 95.25,62.87 96.52,64.14 U$2.23 99.69,64.14 100.97,62.87 115.57,62.87 116.84,64.14 U$3.23 120.65,64.14 121.92,62.87 v136.84,62.87 | SV2.26 156.84,64.14 153.99,64.14 141.29,51.44 v136.84,51.44 | v73.98,43.81 28.57,43.81 27.3,45.09 24.45,45.09 23.81,45.72 23.81,48.26 24.45,48.9 U$5.17
  Bottom 0.61: U$4.23 v73.98,64.14
A11_CPU
  Bottom 0.406: U$5.18 33.34,51.44 34.61,52.7 34.61,57.78 IC2.40
A12  (via drill 0.6 pad 1.42)
  Top 0.406: v138.43,53.98 v138.43,50.16 | v76.2,55.24 v76.2,40.01
  Bottom 0.406: v76.2,55.24 79.38,55.24 80.64,53.98 U$4.2 95.25,53.98 96.52,55.24 99.69,55.24 100.97,53.98 U$2.2 115.57,53.98 116.84,55.24 120.65,55.24 121.92,53.98 U$3.2 | v138.43,50.16 141.29,50.16 153.99,62.87 SV2.27 | U$5.10 20.95,43.81 24.77,40.01 v76.2,40.01
  Bottom 0.61: U$3.2 v138.43,53.98
A12_CPU
  Bottom 0.406: IC2.37 32.07,66.67 30.8,65.41 20.32,65.41 19.68,64.77 19.68,61.91 18.1,60.33 18.1,53.02 13.65,48.58 13.65,47.31 12.7,46.35 U$5.9
A13  (via drill 0.6 pad 1.42)
  Top 0.406: v140.34,53.98 v140.34,48.9 | v59.37,62.87 v59.37,57.78
  Bottom 0.406: SV2.28 156.84,61.59 153.99,61.59 141.29,48.9 v140.34,48.9 | v140.34,53.98 139.06,55.24 121.92,55.24 120.65,56.52 U$3.26 116.84,56.52 115.57,55.24 100.97,55.24 99.69,56.52 U$2.26 96.52,56.52 95.25,55.24 80.64,55.24 79.38,56.52 U$4.26 70.8,56.52 69.53,57.78 v59.37,57.78 | U$5.21 28.26,59.05 32.07,62.87 v59.37,62.87
A13_CPU
  Bottom 0.406: IC2.38 32.07,64.14 29.53,61.59 U$5.22
A14  (via drill 0.6 pad 1.42)
  Top 0.406: v89.53,51.44 v89.53,43.81 | v36.83,53.98 v33.34,53.98
  Bottom 0.406: 96.52,43.81 v89.53,43.81 137.48,43.81 153.99,60.33 SV2.29 | U$5.19 v33.34,53.98 | v36.83,53.98 50.16,53.98 51.44,52.7 79.38,52.7 80.64,51.44 v89.53,51.44 U$4.1 95.25,51.44 96.52,52.7 99.69,52.7 100.97,51.44 U$2.1
A14_CPU
  Bottom 0.406: IC2.39 32.07,61.59 26.99,56.52 U$5.20
A15  (via drill 0.6 pad 1.42)
  Top 0.406: v108.58,18.41 v108.58,42.55
  Bottom 0.406: SV2.30 156.84,59.05 153.99,59.05 137.48,42.55 v108.58,42.55 24.45,42.55 21.91,45.09 9.21,45.09 8.57,45.72 8.57,48.26 9.21,48.9 U$5.8
  Bottom 0.61: IC6.14 v108.58,18.41
A15_CPU
  Bottom 0.406: IC2.36 20.64,69.22 18.73,67.31 18.73,62.23 17.14,60.64 17.14,53.34 15.24,51.44 U$5.7
AEN  (via drill 0.6 pad 1.42)
  Top 0.406: v55.56,66.67 v55.56,80.64 | v28.89,71.75 v28.89,80.64 | v13.34,66.67 v13.34,33.66 | v129.86,15.88 v129.86,27.62
  Bottom 0.406: v55.56,80.64 38.1,80.64 35.88,78.42 35.88,73.66 35.24,73.03 31.75,73.03 30.48,71.75 v28.89,71.75 U$6.1 | v28.89,80.64 24.45,80.64 21.91,78.11 9.21,78.11 8.57,77.47 8.57,67.31 9.21,66.67 U$5.1 | v13.34,33.66 19.68,27.3 34.92,27.3 41.27,20.95 82.87,20.95 89.53,27.62 v129.86,27.62 137.79,27.62 153.99,43.81 156.84,43.81 SV2.42
  Bottom 0.61: IC3.22 v55.56,66.67 | U$5.1 v13.34,66.67 | v129.86,15.88 IC9.4
CLK  (via drill 0.6 pad 1.42)
  Top 0.406: v87,102.87 v87,34.92
  Bottom 0.406: v87,34.92 137.48,34.92 153.99,51.44 156.84,51.44 SV2.36
  Bottom 0.61: IC1.6 v87,102.87
CS_0
  Bottom 0.406: IC9.15 145.41,20.95 149.22,24.77 SV2.57
CS_1
  Bottom 0.406: IC9.14 144.78,18.41 149.86,23.5 156.84,23.5 SV2.58
CS_2
  Bottom 0.406: IC9.13 144.15,15.88 150.5,22.23 SV2.59
CS_3
  Bottom 0.406: IC9.12 143.51,13.34 151.13,20.95 156.84,20.95 SV2.60
CS_4
  Bottom 0.406: IC9.11 142.88,10.79 151.76,19.68 SV2.61
CS_5
  Bottom 0.406: IC9.10 142.24,8.26 152.4,18.41 156.84,18.41 SV2.62
CS_6
  Bottom 0.406: IC9.9 145.1,5.71 146.05,6.67 146.05,10.16 153.03,17.14 SV2.63
CS_EPROM  (via drill 0.6 pad 1.42)
  Top 0.406: v109.86,14.61 v109.86,70.48
  Bottom 0.406: U$3.20 116.84,71.75 115.57,70.48 v109.86,70.48 | v109.86,14.61 105.41,14.61 104.14,13.34 IC6.12
CS_PORT_OUT
  Bottom 0.406: IC5.9 IC9.7
CS_RAM1  (via drill 0.6 pad 1.42)
  Top 0.406: v90.81,70.48 v90.81,9.53
  Bottom 0.406: U$4.20 79.38,71.75 80.64,70.48 v90.81,70.48 | v90.81,9.53 97.16,9.53 98.42,8.26 IC6.10
CS_RAM2  (via drill 0.6 pad 1.42)
  Top 0.406: v106.05,70.48 v106.05,8.26
  Bottom 0.406: U$2.20 99.69,71.75 100.97,70.48 v106.05,70.48
  Bottom 0.61: v106.05,8.26 IC5.6
D0  (via drill 0.6 pad 1.42)
  Top 0.406: v106.05,87.63 v106.05,76.83 | v146.37,76.83 v146.37,84.45 | v73.34,78.11 v73.34,81.92
  Bottom 0.406: v73.34,78.11 79.38,78.11 80.64,76.83 U$4.11 95.25,76.83 96.52,78.11 99.69,78.11 100.97,76.83 v106.05,76.83 U$2.11 115.57,76.83 116.84,78.11 120.65,78.11 121.92,76.83 U$3.11 v146.37,76.83 | SV2.7 150.18,88.27 v146.37,84.45 | v73.34,81.92 IC3.13 | U$1.3 v106.05,87.63
D1  (via drill 0.6 pad 1.42)
  Top 0.406: v111.12,89.22 v111.12,79.38 | v148.59,79.38 v148.59,84.45
  Bottom 0.406: v148.59,79.38 U$3.12 121.92,79.38 120.65,80.64 116.84,80.64 115.57,79.38 U$2.12 v111.12,79.38 100.97,79.38 99.69,80.64 96.52,80.64 95.25,79.38 U$4.12 80.64,79.38 79.38,80.64 57.47,80.64 56.2,81.92 IC3.16 | SV2.8 156.84,87 151.13,87 v148.59,84.45 | v111.12,89.22 U$1.5
D2  (via drill 0.6 pad 1.42)
  Top 0.406: v122.56,84.45 v122.56,81.92 | v150.81,81.92 v150.81,84.45 | v65.72,83.19 v65.72,76.83
  Bottom 0.406: v150.81,81.92 U$3.13 v122.56,81.92 121.92,81.92 120.65,83.19 116.84,83.19 115.57,81.92 U$2.13 100.97,81.92 99.69,83.19 96.52,83.19 95.25,81.92 U$4.13 80.64,81.92 79.38,83.19 v65.72,83.19 | SV2.9 152.08,85.72 v150.81,84.45 | v122.56,84.45 116.2,90.81 U$1.7
  Bottom 0.61: v65.72,76.83 IC3.11
D3  (via drill 0.6 pad 1.42)
  Top 0.406: v72.07,84.45 v72.07,71.75
  Bottom 0.406: 125.73,83.19 121.92,83.19 120.65,84.45 U$3.15 116.84,84.45 115.57,83.19 100.97,83.19 99.69,84.45 U$2.15 96.52,84.45 95.25,83.19 80.64,83.19 79.38,84.45 U$4.15 v72.07,84.45 | 125.73,83.19 152.08,83.19 153.35,84.45 156.84,84.45 SV2.10 | U$1.9 121.28,89.53 125.73,85.09 125.73,83.19
  Bottom 0.61: v72.07,71.75 IC3.9
D4  (via drill 0.6 pad 1.42)
  Top 0.406: v129.54,84.45 v129.54,80.64 | v75.25,81.92 v75.25,61.59
  Bottom 0.406: U$4.16 79.38,81.92 80.64,80.64 95.25,80.64 96.52,81.92 U$2.16 99.69,81.92 100.97,80.64 115.57,80.64 116.84,81.92 U$3.16 120.65,81.92 121.92,80.64 v129.54,80.64 151.45,80.64 153.99,83.19 SV2.11 | U$1.16 121.28,100.97 127.64,94.61 127.64,89.22 129.54,87.31 v129.54,84.45 | v75.25,61.59 IC3.5
  Bottom 0.61: U$4.16 v75.25,81.92
D5  (via drill 0.6 pad 1.42)
  Top 0.406: v128.27,86.68 v128.27,78.11
  Bottom 0.406: SV2.12 156.84,81.92 153.99,81.92 150.18,78.11 v128.27,78.11 121.92,78.11 120.65,79.38 U$3.17 116.84,79.38 115.57,78.11 100.97,78.11 99.69,79.38 U$2.17 96.52,79.38 95.25,78.11 80.64,78.11 79.38,79.38 U$4.17 70.8,79.38 69.53,78.11 56.2,78.11 54.93,76.83 IC3.18 | U$1.18 116.2,104.78 125.09,95.89 125.09,89.85 v128.27,86.68
D6  (via drill 0.6 pad 1.42)
  Top 0.406: v127,85.41 v127,75.56
  Bottom 0.406: SV2.13 153.99,80.64 148.91,75.56 v127,75.56 121.92,75.56 120.65,76.83 U$3.18 116.84,76.83 115.57,75.56 100.97,75.56 99.69,76.83 U$2.18 96.52,76.83 95.25,75.56 80.64,75.56 79.38,76.83 U$4.18 71.12,76.83 69.85,75.56 61.28,75.56 57.47,71.75 IC3.20 | U$1.20 111.12,106.05 122.56,94.61 122.56,89.85 v127,85.41
D7  (via drill 0.6 pad 1.42)
  Top 0.406: v104.78,89.22 v104.78,73.03 | v73.98,66.67 v73.98,74.3
  Bottom 0.406: U$4.19 79.38,74.3 80.64,73.03 95.25,73.03 96.52,74.3 U$2.19 99.69,74.3 100.97,73.03 v104.78,73.03 115.57,73.03 116.84,74.3 U$3.19 120.65,74.3 121.92,73.03 147.64,73.03 153.99,79.38 156.84,79.38 SV2.14 | U$1.22 106.05,95.89 104.78,94.61 v104.78,89.22
  Bottom 0.61: U$4.19 v73.98,74.3 | v73.98,66.67 IC3.7
DA0
  Bottom 0.406: IC2.10 50.16,81.92 50.8,82.55 50.8,83.82 51.44,84.45 IC3.15
DA1
  Bottom 0.406: IC2.9 IC3.17
DA2
  Bottom 0.406: IC2.8 50.48,76.83 51.75,78.11 54.93,78.11 56.2,79.38 IC3.12
DA3  (via drill 0.6 pad 1.42)
  Top 0.406: v61.91,76.83 v61.91,74.3
  Bottom 0.406: IC2.7 50.48,74.3 51.75,75.56 54.93,75.56 56.2,76.83 v61.91,76.83
  Bottom 0.61: v61.91,74.3 IC3.10
DA4  (via drill 0.6 pad 1.42)
  Top 0.406: v61.91,65.41 v61.91,62.87
  Bottom 0.406: IC2.3 50.48,64.14 51.75,65.41 v61.91,65.41 | IC3.6 64.14,64.14 62.87,62.87 v61.91,62.87
DA5
  Bottom 0.406: IC2.4 46.99,66.67 46.35,67.31 46.35,72.39 46.99,73.03 50.48,73.03 51.75,74.3 IC3.19
DA6
  Bottom 0.406: IC2.5 IC3.21
DA7
  Bottom 0.406: IC3.8 55.56,69.22 54.29,70.48 51.75,70.48 50.48,71.75 IC2.6
FI1
  Bottom 0.406: IC2.22 46.04,104.78 47.31,103.5 61.59,103.5 62.87,102.23 79.69,102.23 80.33,102.87 IC1.11
FI2  (via drill 0.6 pad 1.42)
  Top 0.406: v66.67,104.46 v66.67,94.61
  Bottom 0.406: v66.67,94.61 IC2.15 | IC1.10 80.33,105.41 79.38,104.46 v66.67,104.46
GND  (via drill 0.6 pad 1.42)
  Top 0.61: v15.88,69.53 v15.88,73.98 | v20,46.99 v20,39.37 | v147,99.06 v147,87.63 | v68.9,112.39 v68.9,97.16 | v96.84,118.75 v96.84,113.67 | v69.53,18.41 v69.53,45.72 | v46.04,61.59 v46.04,112.39 | v41.59,99.69 v41.59,112.39
  Bottom 1.016: 118.64,45.49 C3.2 118.72,45.46
  pour Bottom (isolate 0.406, no thermals): 0,122.56 0,0 167.64,0 167.64,122.56
HLDA  (via drill 0.6 pad 1.42)
  Top 0.406: v64.45,53.98 v64.45,104.46 | v62.87,53.98 v62.87,23.5
  Bottom 0.406: IC2.21 35.24,107.31 36.51,106.05 61.59,106.05 63.18,104.46 v64.45,104.46 | v62.87,23.5 82.23,23.5 91.12,32.38 137.48,32.38 153.99,48.9 156.84,48.9 SV2.38
  Bottom 0.61: IC3.2 v64.45,53.98 v62.87,53.98
HRQ  (via drill 0.6 pad 1.42)
  Top 0.406: v41.91,22.23 v41.91,89.53
  Bottom 0.406: SV2.41 153.99,45.09 137.79,28.89 89.22,28.89 82.55,22.23 v41.91,22.23
  Bottom 0.61: v41.91,89.53 IC2.13
INT  (via drill 0.6 pad 1.42)
  Top 0.406: v43.18,92.08 v43.18,24.77 | v80.64,40.01 v80.64,24.77
  Bottom 0.406: v80.64,40.01 137.48,40.01 153.99,56.52 156.84,56.52 SV2.32 | v43.18,24.77 v80.64,24.77
  Bottom 0.61: IC2.14 v43.18,92.08
INTA  (via drill 0.6 pad 1.42)
  Top 0.406: v58.1,64.14 v58.1,38.73
  Bottom 0.406: v58.1,38.73 137.48,38.73 153.99,55.24 SV2.33
  Bottom 0.61: IC3.23 v58.1,64.14
IO_RD  (via drill 0.6 pad 1.42)
  Top 0.406: v55.56,59.05 v55.56,37.47
  Bottom 0.406: v55.56,37.47 137.48,37.47 153.99,53.98 156.84,53.98 SV2.34
  Bottom 0.61: IC3.25 v55.56,59.05
IO_WR  (via drill 0.6 pad 1.42)
  Top 0.406: v60.33,53.98 v60.33,36.2 | v100.97,88.9 v100.97,36.2
  Bottom 0.406: v60.33,36.2 v100.97,36.2 137.48,36.2 153.99,52.7 SV2.35 | U$1.1 v100.97,88.9
  Bottom 0.61: IC3.27 v60.33,53.98
N$1  (via drill 0.6 pad 1.42)
  Top 0.406: v63.18,59.05 v63.18,99.69
  Bottom 0.406: IC2.17 v63.18,99.69
  Bottom 0.61: IC3.4 v63.18,59.05
N$2
  Bottom 0.406: IC6.2 98.42,20.95 100.33,19.05 100.33,12.06 101.6,10.79 IC6.11
N$3
  Bottom 0.61: U$1.19 R7.1
N$4
  Bottom 0.61: R7.2 LED1.K
N$5  (via drill 0.6 pad 1.42)
  Top 0.406: v60.64,56.52 v60.64,102.23
  Bottom 0.406: IC3.3 v60.64,56.52 | IC2.18 v60.64,102.23
N$6
  Bottom 0.61: U$1.21 R8.1
N$7
  Bottom 0.61: U$1.2 R1.2
N$8  (via drill 0.6 pad 1.42)
  Top 0.406: v99.06,5.71 v99.06,18.41
  Bottom 0.406: IC6.9 104.46,5.71
  Bottom 0.61: IC6.9 v99.06,5.71 | v99.06,18.41 IC6.3
N$9
  Bottom 0.61: IC1.14 76.71,95.25 Q1.2
N$10
  Bottom 0.61: C17.2 76.71,92.71 Q1.1
N$11
  Bottom 0.61: C17.1 IC1.15
N$12
  Bottom 0.406: IC1.2 R3.1 93.03,93.98 93.66,94.61 D1.A
  Bottom 0.61: D1.A JP1.2 C19.1
N$13
  Bottom 0.406: U$6.14
  Bottom 0.61: U$6.14 U$6.13 20.32,99.69 | 20.32,99.69 22.86,97.16 U$6.11 | R5.2 20.32,99.69
N$15  (via drill 0.6 pad 1.42)
  Top 0.61: v29.84,38.73 v29.84,41.27
  Bottom 0.406: U$5.11 22.23,41.27 24.77,38.73 U$5.13
  Bottom 0.61: U$5.14 v29.84,41.27 | U$5.13 v29.84,38.73 R4.2
N$16
  Bottom 0.406: IC6.7 97.16,8.26 98.42,6.99 116.52,6.99 117.16,7.62 117.16,9.84 116.2,10.79 IC5.5
N$17
  Bottom 0.61: R8.2 LED2.K
N$23  (via drill 0.6 pad 1.27)
  other vias: 5,117.39
N$24  (via drill 0.6 pad 1.27)
  other vias: 162.48,5
N$25  (via drill 0.6 pad 1.27)
  other vias: 162.48,117.39
N$37  (via drill 0.6 pad 1.27)
  other vias: 5,5
NEG_5V  (via drill 0.6 pad 1.42)
  Top 0.61: v55.56,86.68 v55.56,117.47
  Bottom 0.61: IC2.11 49.53,84.45 51.75,86.68 v55.56,86.68
  Bottom 0.813: C8.1 IC2.11
  Bottom 1.016: X1.1 v55.56,117.47 C7.-
OUT_1
  Bottom 0.406: SV2.3 135.57,93.34 129.22,99.69 125.73,99.69 123.83,101.6 U$1.15
OUT_2
  Bottom 0.406: SV2.4 156.84,92.08 135.57,92.08 128.91,98.74 125.09,98.74 122.56,101.28 122.56,109.54 121.92,110.17 119.38,110.17 118.75,109.54 U$1.17
OUT_3  (via drill 0.6 pad 1.42)
  Top 0.406: v121.92,97.16 v127,97.16
  Bottom 0.406: SV2.5 135.57,90.81 129.22,97.16 v127,97.16 | U$1.10 123.83,95.25 v121.92,97.16
OUT_4  (via drill 0.6 pad 1.42)
  Top 0.406: v113.67,95.57 v128.91,95.57
  Bottom 0.406: SV2.6 156.84,89.53 134.94,89.53 v128.91,95.57
  Bottom 0.61: U$1.6 v113.67,95.57
PULLUP_5V
  Bottom 0.61: R9.1 136.21,11.75 135.25,10.79 IC9.6 126.36,10.79 | 126.36,10.79 IC5.10 121.28,10.79 118.75,13.34 IC5.4 | IC5.12 124.46,15.88 126.36,13.97 126.36,10.79
RD  (via drill 0.6 pad 1.42)
  Top 0.406: v129.86,65.41 v129.86,31.11
  Bottom 0.406: IC3.24 60.01,61.59 60.64,62.23 60.64,63.5 61.28,64.14 62.87,64.14 64.14,65.41 74.61,65.41 75.88,66.67 U$4.22 79.38,66.67 80.64,65.41 95.25,65.41 96.52,66.67 U$2.22 99.69,66.67 100.97,65.41 115.57,65.41 116.84,66.67 U$3.22 120.65,66.67 121.92,65.41 v129.86,65.41 | v129.86,31.11 137.48,31.11 153.99,47.62 SV2.39
RDYIN  (via drill 0.6 pad 1.42)
  Top 0.406: v134.3,100.65 v94.3,100.65
  Bottom 0.406: v134.3,100.65 139.06,95.89 SV2.1 | IC1.3 92.71,95.25 94.3,96.84 v94.3,100.65
  Bottom 0.61: IC1.3 R2.1
READY
  Bottom 0.406: IC2.23 46.04,102.23 47.31,100.97 79.69,100.97 80.33,101.6 83.19,101.6 87,97.79 IC1.4
RESET  (via drill 0.6 pad 1.42)
  Top 0.406: v44.45,41.27 v44.45,87 | v120.33,18.41 v120.33,41.27
  Bottom 0.406: IC1.1 87.63,90.17 85.41,87.95 51.12,87.95 50.16,87 IC2.12 | SV2.31 153.99,57.78 137.48,41.27 v120.33,41.27 v44.45,41.27
  Bottom 0.61: v44.45,87 IC2.12 | v120.33,18.41 IC5.13
SHADOW_ROM  (via drill 0.6 pad 1.42)
  Top 0.406: v107.31,89.53 v107.31,15.88
  Bottom 0.406: U$1.8 118.75,95.89 117.47,97.16 109.22,97.16 107.31,95.25 v107.31,89.53
  Bottom 0.61: IC6.13 v107.31,15.88
SSTB  (via drill 0.6 pad 1.42)
  Top 0.406: v70.8,105.73 v70.8,51.44
  Bottom 0.406: IC1.7 84.45,105.41 83.19,106.68 80.33,106.68 79.38,105.73 v70.8,105.73
  Bottom 0.61: v70.8,51.44 IC3.1
SYNC
  Bottom 0.406: IC1.5 87,100.33 83.19,104.14 80.33,104.14 79.38,103.19 63.18,103.19 61.59,104.78 IC2.19
VCC  (via drill 0.6 pad 1.42)
  Top 0.61: v85.72,91.44 v85.72,116.2 | v20,73.03 v20,66.67 | v13.97,109.86 v13.97,71.75 | v50.8,48.26 v50.8,109.86 | v37.47,48.26 v37.47,38.73 | v93.34,25.4 v93.34,48.26
  Bottom 0.406: v85.72,91.44 91.12,91.44 91.55,91.01 R3.2 | C21.1 21.91,66.67 | C14.1
  Bottom 0.61: C3.1 126.98,48.24 130.18,51.44 U$3.1 | R2.2 v85.72,91.44 84.45,90.17 IC1.16 C18.1 | R3.2 D1.C | v20,66.67 21.91,66.67 U$5.24 | v20,73.03 18.73,71.75 v13.97,71.75 U$6.24 10.79,69.72 C22.1 | R9.2 136.21,25.4 | C11.1 48.58,110.17 48.9,109.86
  Bottom 0.813: v93.34,25.4 103.5,25.4 | 103.5,25.4 122.56,25.4 | 122.56,25.4 136.21,25.4 139.06,25.4 140.02,24.45 IC9.16 C13.1 | 103.5,25.4 IC6.16 C12.1 | C14.1 122.56,25.4 | 122.56,25.4 | U$1.24 100.97,106.05 103.5,103.5 R1.1 | IC5.14 C14.1 | C14.1 | C14.1 | R4.1 v37.47,38.73
  Bottom 1.016: 118.72,48.26 C3.1 | U$1.24 C9.1 | v50.8,48.26 44.45,48.26 v37.47,48.26 | C16.+ 16.83,109.54 16.51,109.86
  Bottom 1.27: U$2.28 C2.1 | U$4.28 C1.1 | U$3.27 U$3.28 C3.1 118.72,48.26 101.92,48.26 C2.1 | C1.1 | C1.1 C6.1 | C6.1 v50.8,48.26 | C2.1 | C6.1 IC3.28 | LED2.A C9.1 v85.72,116.2 79.38,109.86 v50.8,109.86 48.9,109.86 48.58,109.86 | 48.58,109.86 X1.4 R5.1 16.51,109.86 v13.97,109.86 C23.+ | IC2.20 48.58,109.86 | C1.1 v93.34,48.26 C2.1
  Bottom 1.422: LED2.A LED1.A C10.+
WR  (via drill 0.6 pad 1.42)
  Top 0.406: v103.5,52.7 v103.5,31.11
  Bottom 0.406: IC3.26 58.42,56.52 59.69,55.24 69.53,55.24 70.8,53.98 U$4.27 79.38,53.98 80.64,52.7 95.25,52.7 96.52,53.98 U$2.27 99.69,53.98 100.97,52.7 v103.5,52.7 | SV2.40 156.84,46.35 153.99,46.35 137.48,29.84 129.22,29.84 127.95,31.11 v103.5,31.11